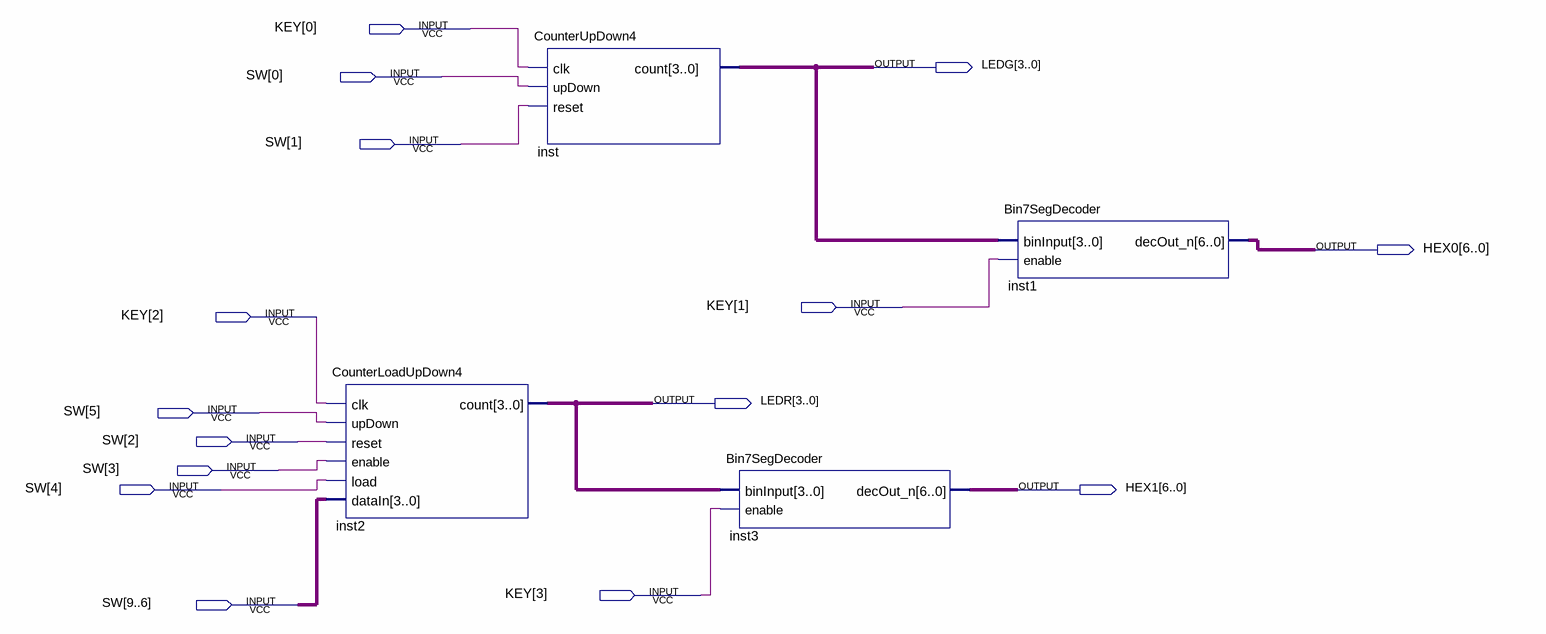
[diagram p0: schematic sheet]
// Quartus schematic Counter_Demo.bdf as structural Verilog: 4 symbols, 15 pins
module Counter_Demo (
  input  [3:0] KEY,
  input  [9:0] SW,
  output [3:0] LEDG,
  output [6:0] HEX0,
  output [3:0] LEDR,
  output [6:0] HEX1
);

  CounterLoadUpDown4 inst2 (
    .clk(KEY[2]), .upDown(SW[5]), .reset(SW[2]), .enable(SW[3]), .load(SW[4]), .dataIn(SW[9:6]), .count(LEDR));
  CounterUpDown4 inst (.clk(KEY[0]), .upDown(SW[0]), .reset(SW[1]), .count(LEDG));
  Bin7SegDecoder inst3 (.binInput(LEDR), .enable(KEY[3]), .decOut_n(HEX1));
  Bin7SegDecoder inst1 (.binInput(LEDG), .enable(KEY[1]), .decOut_n(HEX0));
endmodule
